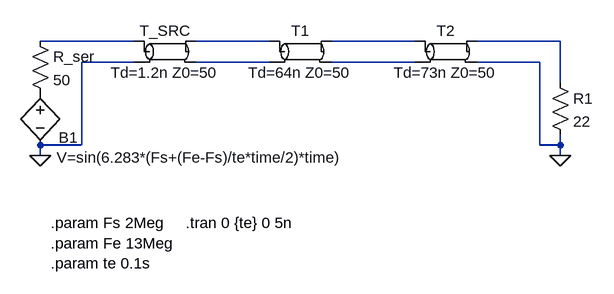
[diagram p0: schematic p3_sweep.asc]
p3_sweep.asc, the LTspice schematic file:
Version 4
SHEET 1 900 680
WIRE 176 224 32 224
WIRE 384 224 272 224
WIRE 608 224 480 224
WIRE 832 224 704 224
WIRE 176 256 96 256
WIRE 384 256 272 256
WIRE 608 256 480 256
WIRE 800 256 704 256
WIRE 832 288 832 224
WIRE 96 384 96 256
WIRE 96 384 32 384
WIRE 800 384 800 256
WIRE 832 384 832 368
WIRE 832 384 800 384
WIRE 32 400 32 384
WIRE 832 400 832 384
FLAG 32 400 0
FLAG 832 400 0
SYMBOL tline 432 240 R0
SYMATTR InstName T1
SYMATTR Value Td=64n Z0=50
SYMBOL tline 656 240 R0
SYMATTR InstName T2
SYMATTR Value Td=73n Z0=50
SYMBOL Res 816 272 R0
SYMATTR InstName R1
SYMATTR Value 22
SYMBOL tline 224 240 R0
SYMATTR InstName T_SRC
SYMATTR Value Td=1.2n Z0=50
SYMBOL bv 32 288 R0
WINDOW 0 28 84 Left 2
WINDOW 3 25 115 Left 2
SYMATTR InstName B1
SYMATTR Value V=sin(6.283*(Fs+(Fe-Fs)/te*time/2)*time)
SYMBOL Res 16 208 R0
SYMATTR InstName R_ser
SYMATTR Value 50
TEXT 256 504 Left 2 !.tran 0 {te} 0 5n
TEXT 48 504 Left 2 !.param Fs 2Meg\n.param Fe 13Meg\n.param te 0.1s

The netlist it stands for:
* p3_sweep.asc
T1 N002 N005 N003 N006 Td=64n Z0=50
T2 N003 N006 N004 0 Td=73n Z0=50
R1 N004 0 22
T_SRC N001 0 N002 N005 Td=1.2n Z0=50
B1 P001 0 V=sin(6.283*(Fs+(Fe-Fs)/te*time/2)*time)
R_ser N001 P001 50
.tran 0 {te} 0 5n
.param Fs 2Meg
.param Fe 13Meg
.param te 0.1s
.backanno
.end